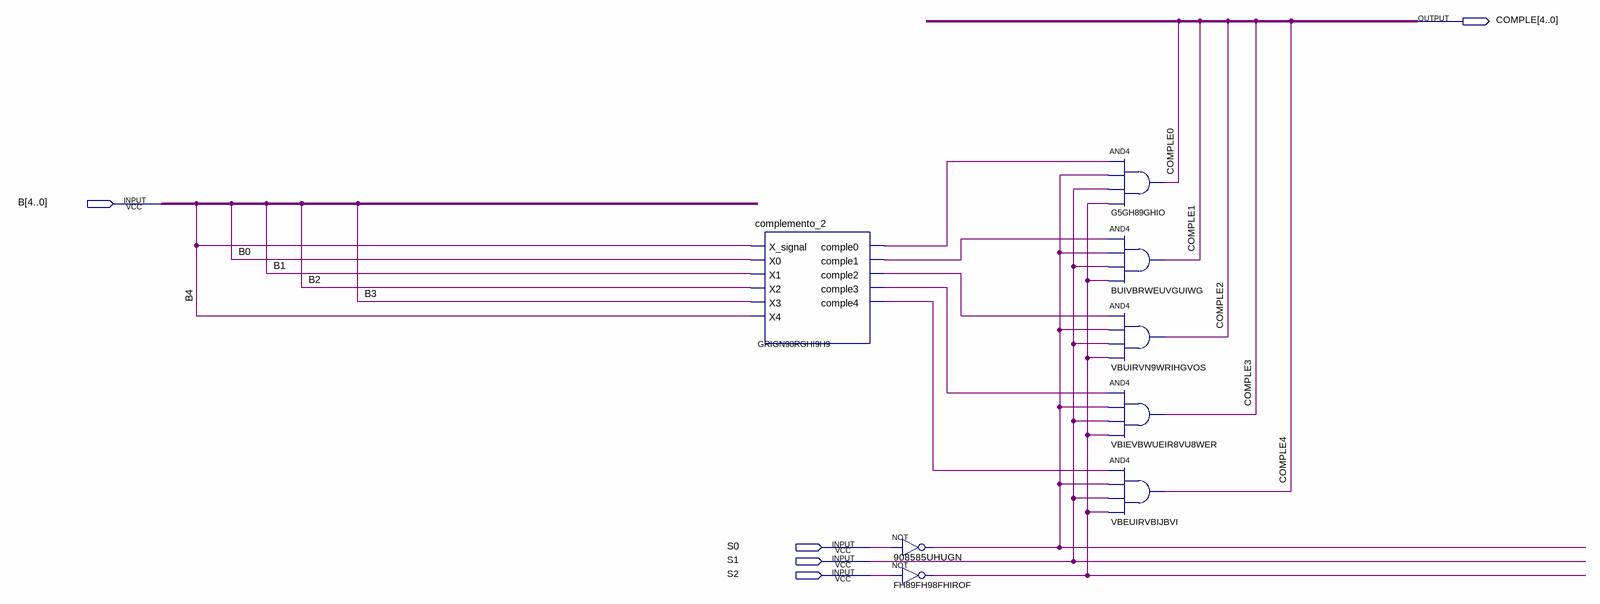
[diagram p0: schematic sheet]
// Quartus schematic COMPLE_2_B.bdf as structural Verilog: 8 symbols, 5 pins
module COMPLE_2_B (
  input  [4:0] B,
  input  S0,
  input  S1,
  input  S2,
  output [4:0] COMPLE
);

  wire FH89FH98FHIROF_out, GRIGN98RGHI9H9_comple0, GRIGN98RGHI9H9_comple1, GRIGN98RGHI9H9_comple2,
       GRIGN98RGHI9H9_comple3, GRIGN98RGHI9H9_comple4, n908585UHUGN_out;

  complemento_2 GRIGN98RGHI9H9 (
    .X_signal(B[4]), .X0(B[0]), .X1(B[1]), .X2(B[2]), .X3(B[3]), .X4(B[4]), .comple0(GRIGN98RGHI9H9_comple0),
    .comple1(GRIGN98RGHI9H9_comple1), .comple2(GRIGN98RGHI9H9_comple2), .comple3(GRIGN98RGHI9H9_comple3),
    .comple4(GRIGN98RGHI9H9_comple4));
  not u_908585UHUGN (n908585UHUGN_out, S0);
  not FH89FH98FHIROF (FH89FH98FHIROF_out, S2);
  and G5GH89GHIO (COMPLE[0], GRIGN98RGHI9H9_comple0, n908585UHUGN_out, S1, FH89FH98FHIROF_out);
  and BUIVBRWEUVGUIWG (COMPLE[1], GRIGN98RGHI9H9_comple1, n908585UHUGN_out, S1, FH89FH98FHIROF_out);
  and VBUIRVN9WRIHGVOS (COMPLE[2], GRIGN98RGHI9H9_comple2, n908585UHUGN_out, S1, FH89FH98FHIROF_out);
  and VBIEVBWUEIR8VU8WER (COMPLE[3], GRIGN98RGHI9H9_comple3, n908585UHUGN_out, S1, FH89FH98FHIROF_out);
  and VBEUIRVBIJBVI (COMPLE[4], GRIGN98RGHI9H9_comple4, n908585UHUGN_out, S1, FH89FH98FHIROF_out);
endmodule
